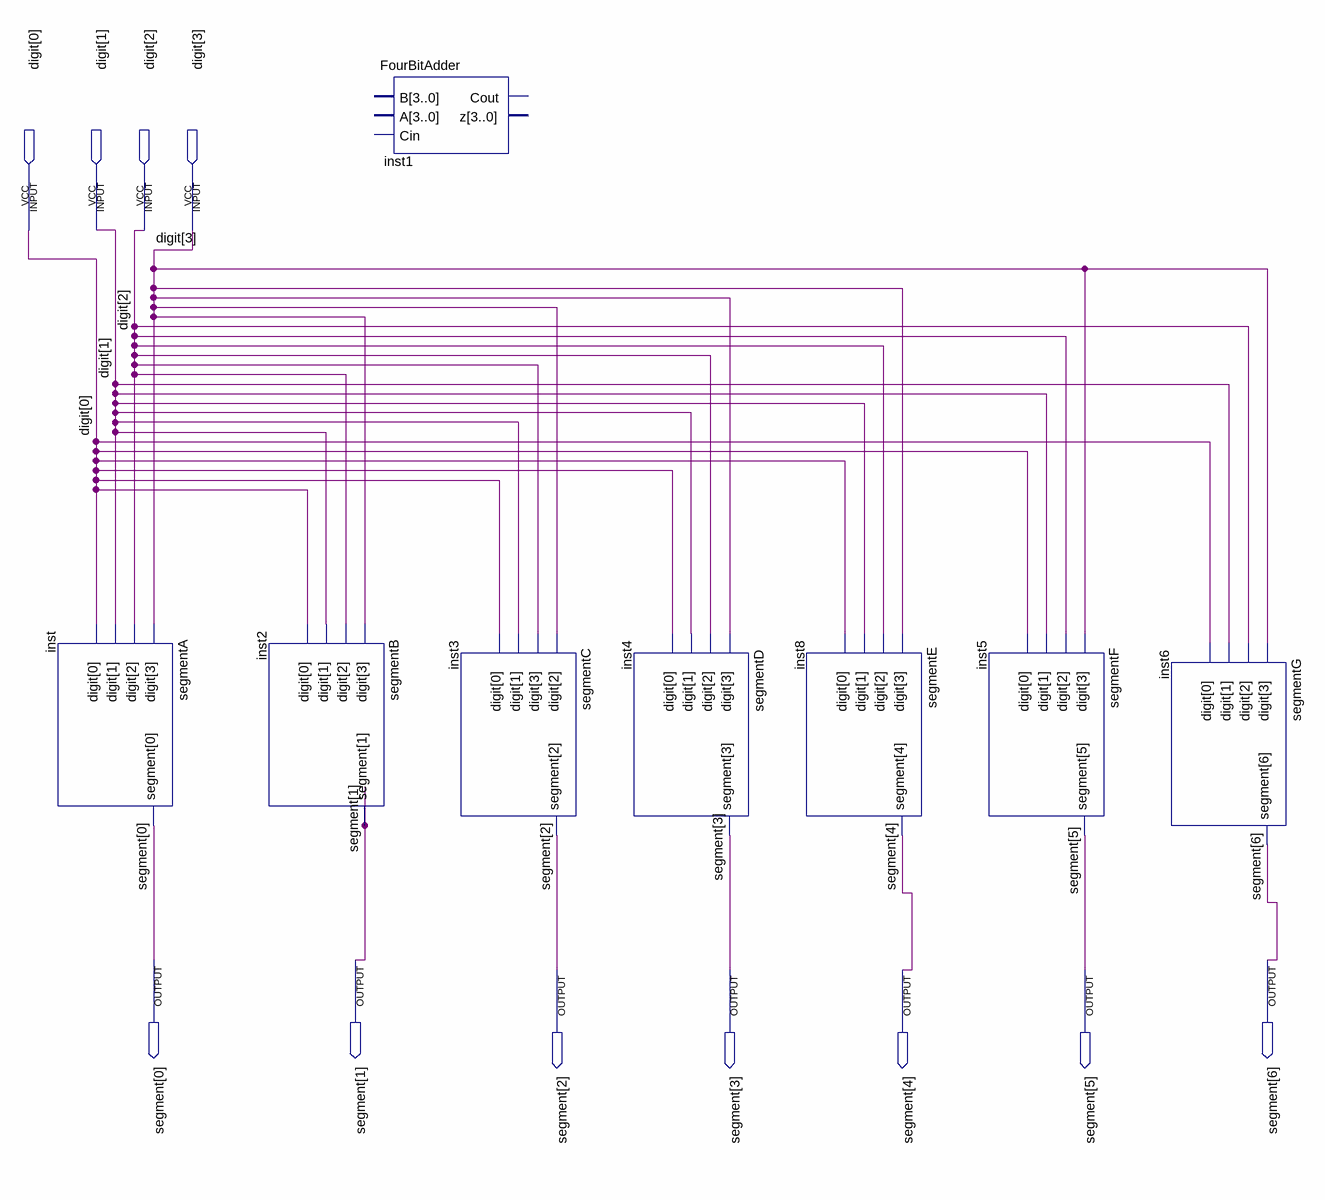
[diagram p0: schematic sheet]
// Quartus schematic SevenSegmentDisplay.bdf as structural Verilog: 8 symbols, 11 pins
module SevenSegmentDisplay (
  input  [3:0] digit,
  output [6:0] segment
);

  segmentA inst (.digit(digit), .segment(segment[0]));
  segmentB inst2 (.digit(digit), .segment(segment[1]));
  FourBitAdder inst1 ();  // open: B, A, Cin, Cout, z
  segmentC inst3 (.digit({digit[2], digit[3], digit[1:0]}), .segment(segment[2]));
  segmentD inst4 (.digit(digit), .segment(segment[3]));
  segmentE inst8 (.digit(digit), .segment(segment[4]));
  segmentF inst5 (.digit(digit), .segment(segment[5]));
  segmentG inst6 (.digit(digit), .segment(segment[6]));
endmodule
